# EAGLE schematic schematic, v.2 (EAGLE 9.2.0)
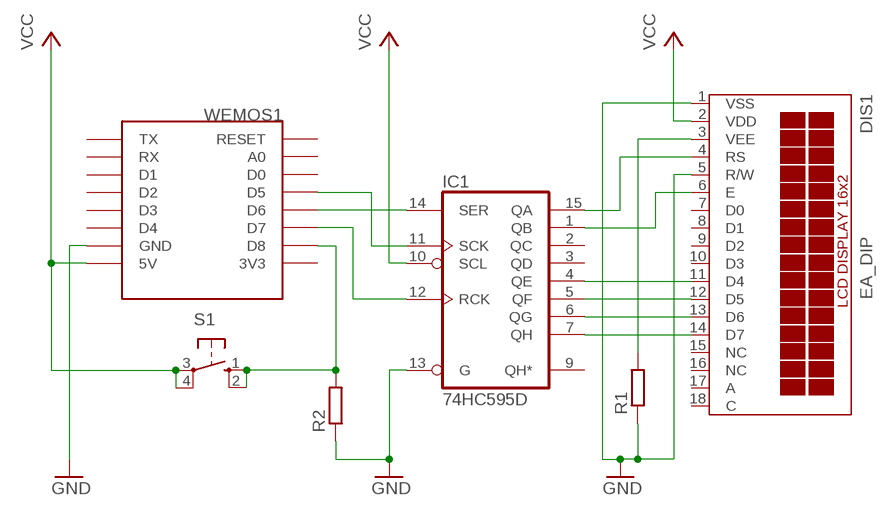
[diagram p0: schematic, sheet 1]

## Parts
DIS1  EA_DIP  [EA_DIP]
IC1  74HC595D  [SO16]
R1  R-EU_0204/2V  [0204V]
R2  R-EU_0204/2V  [0204V]
S1  10-XX  [B3F-10XX]
WEMOS1  WEMOS-D1-MINI  [WEMOS-D1-MINI]

## Nets
GND: DIS1.1(VSS) DIS1.5(R/W) IC1.13(G) R1.1 R2.1 WEMOS1.GND
N$1: IC1.11(SCK) WEMOS1.D5
N$2: DIS1.4(RS) IC1.15(QA)
N$3: DIS1.3(VEE) R1.2
N$4: DIS1.13(D6) IC1.6(QG)
N$5: DIS1.6(E) IC1.1(QB)
N$6: DIS1.11(D4) IC1.4(QE)
N$7: DIS1.12(D5) IC1.5(QF)
N$8: DIS1.14(D7) IC1.7(QH)
N$9: IC1.14(SER) WEMOS1.D6
N$10: IC1.12(RCK) WEMOS1.D7
N$11: R2.2 S1.1(S) S1.2(S1) WEMOS1.D8
VCC: DIS1.2(VDD) IC1.10(SCL) S1.3(P) S1.4(P1) WEMOS1.5V
Unconnected: DIS1.7(D0) DIS1.8(D1) DIS1.9(D2) DIS1.10(D3) DIS1.15(NC) DIS1.16(NC) DIS1.17(A) DIS1.18(C) IC1.2(QC) IC1.3(QD) IC1.9(QH*) WEMOS1.3V3 WEMOS1.A0 WEMOS1.D0 WEMOS1.D1 WEMOS1.D2 WEMOS1.D3 WEMOS1.D4 WEMOS1.RESET WEMOS1.RX WEMOS1.TX

## Power pins joined to a net without a drawn wire
GND: IC1.8(GND)
VCC: IC1.16(VCC)

## Library data of the parts
DIS1 = display-lcd:EA_DIP: LCD-MODUL 2x16 - 6,68mm, INKL. KONTROLLER HD44780 Source: Data sheet <http://www.lcd-module.de/pdf/doma/dip162-d.pdf>
IC1 = 74xx-eu:74*595: 8-bit SHIFT REGISTER, output latch
R1 R2 = rcl:R-EU_: RESISTOR, European symbol; SPICEPREFIX: R
S1 = switch-omron:10-XX: OMRON SWITCH; MPN: B3F-1000; OC_FARNELL: 176432; OC_NEWARK: 36M3542
WEMOS1 = esp8266modules:WEMOS-D1-MINI: WeMos.cc D1 mini ESP8266 module